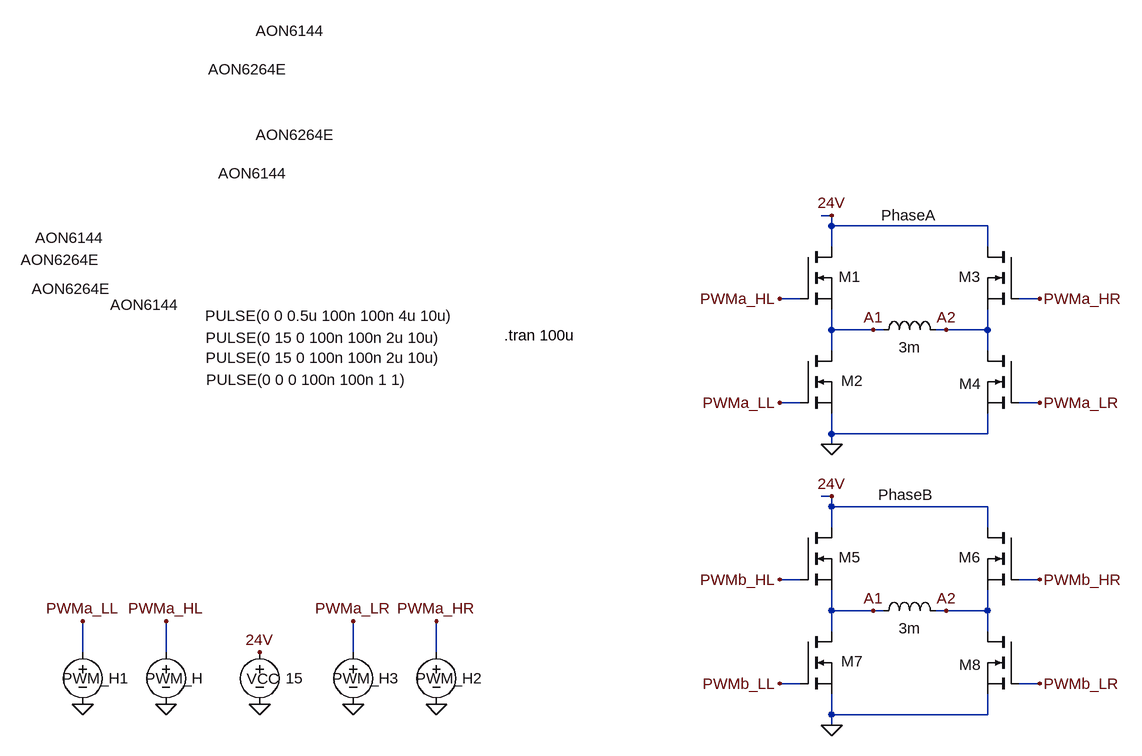
[diagram p0: schematic Stepper motor Driver.asc]
Stepper motor Driver.asc, the LTspice schematic file:
Version 4
SHEET 1 1612 680
WIRE 256 -560 240 -560
WIRE 256 -544 256 -560
WIRE 496 -544 256 -544
WIRE 256 -512 256 -544
WIRE 496 -512 496 -544
WIRE 208 -432 176 -432
WIRE 576 -432 544 -432
WIRE 256 -384 256 -416
WIRE 320 -384 256 -384
WIRE 336 -384 320 -384
WIRE 432 -384 416 -384
WIRE 496 -384 496 -416
WIRE 496 -384 432 -384
WIRE 256 -352 256 -384
WIRE 496 -352 496 -384
WIRE 208 -272 176 -272
WIRE 576 -272 544 -272
WIRE 256 -224 256 -256
WIRE 496 -224 496 -256
WIRE 496 -224 256 -224
WIRE 256 -208 256 -224
WIRE 256 -128 240 -128
WIRE 256 -112 256 -128
WIRE 496 -112 256 -112
WIRE 256 -80 256 -112
WIRE 496 -80 496 -112
WIRE 208 0 176 0
WIRE 576 0 544 0
WIRE 256 48 256 16
WIRE 320 48 256 48
WIRE 336 48 320 48
WIRE 432 48 416 48
WIRE 496 48 496 16
WIRE 496 48 432 48
WIRE 256 80 256 48
WIRE 496 80 496 48
WIRE -896 112 -896 64
WIRE -768 112 -768 64
WIRE -480 112 -480 64
WIRE -352 112 -352 64
WIRE 208 160 176 160
WIRE 576 160 544 160
WIRE 256 208 256 176
WIRE 496 208 496 176
WIRE 496 208 256 208
WIRE 256 224 256 208
FLAG 256 -560 24V
FLAG -624 112 24V
FLAG -624 192 0
FLAG 256 -208 0
FLAG -768 192 0
FLAG -768 64 PWMa_HL
FLAG -896 192 0
FLAG -896 64 PWMa_LL
FLAG 176 -432 PWMa_HL
FLAG 176 -272 PWMa_LL
FLAG 576 -432 PWMa_HR
FLAG 576 -272 PWMa_LR
FLAG -352 192 0
FLAG -352 64 PWMa_HR
FLAG -480 192 0
FLAG -480 64 PWMa_LR
FLAG 320 -384 A1
FLAG 432 -384 A2
FLAG 256 -128 24V
FLAG 256 224 0
FLAG 176 0 PWMb_HL
FLAG 176 160 PWMb_LL
FLAG 576 0 PWMb_HR
FLAG 576 160 PWMb_LR
FLAG 320 48 A1
FLAG 432 48 A2
SYMBOL voltage -768 96 R0
WINDOW 123 0 0 Left 0
WINDOW 39 0 0 Left 0
WINDOW 0 -32 56 Left 2
WINDOW 3 61 -437 Left 2
SYMATTR InstName PWM_H
SYMATTR Value PULSE(0 15 0 100n 100n 2u 10u)
SYMBOL voltage -624 96 R0
WINDOW 0 -20 57 Left 2
WINDOW 3 40 56 Left 2
WINDOW 123 0 0 Left 0
WINDOW 39 0 0 Left 0
SYMATTR InstName VCC
SYMATTR Value 15
SYMBOL nmos 208 -352 R0
WINDOW 3 -838 -332 Left 2
WINDOW 0 59 -114 Left 2
SYMATTR Value AON6264E
SYMATTR InstName M1
SYMBOL voltage -896 96 R0
WINDOW 123 0 0 Left 0
WINDOW 39 0 0 Left 0
WINDOW 0 -32 56 Left 2
WINDOW 3 188 -502 Left 2
SYMATTR InstName PWM_H1
SYMATTR Value PULSE(0 0 0.5u 100n 100n 4u 10u)
SYMBOL nmos 544 -352 M0
WINDOW 3 1126 -273 Left 2
WINDOW 0 59 -114 Left 2
SYMATTR Value AON6144
SYMATTR InstName M3
SYMBOL voltage -352 96 R0
WINDOW 123 0 0 Left 0
WINDOW 39 0 0 Left 0
WINDOW 0 -32 56 Left 2
WINDOW 3 -354 -403 Left 2
SYMATTR InstName PWM_H2
SYMATTR Value PULSE(0 0 0 100n 100n 1 1)
SYMBOL voltage -480 96 R0
WINDOW 123 0 0 Left 0
WINDOW 39 0 0 Left 0
WINDOW 0 -32 56 Left 2
WINDOW 3 -227 -468 Left 2
SYMATTR InstName PWM_H3
SYMATTR Value PULSE(0 15 0 100n 100n 2u 10u)
SYMBOL ind 320 -368 R270
WINDOW 0 177 54 VTop 2
WINDOW 3 5 56 VBottom 2
SYMATTR InstName PhaseA
SYMATTR Value 3m
SYMATTR SpiceLine Ipk=10 Rser=0 Rpar=20
SYMBOL nmos 208 -512 R0
WINDOW 3 -838 -332 Left 2
WINDOW 0 63 206 Left 2
SYMATTR Value AON6144
SYMATTR InstName M2
SYMBOL nmos 544 -512 M0
WINDOW 3 1126 -273 Left 2
WINDOW 0 58 211 Left 2
SYMATTR Value AON6264E
SYMATTR InstName M4
SYMBOL nmos 208 80 R0
WINDOW 3 -1183 -527 Left 2
WINDOW 0 59 -114 Left 2
SYMATTR Value AON6264E
SYMATTR InstName M5
SYMBOL nmos 544 80 M0
WINDOW 3 1292 -503 Left 2
WINDOW 0 59 -114 Left 2
SYMATTR Value AON6144
SYMATTR InstName M6
SYMBOL ind 320 64 R270
WINDOW 0 179 50 VTop 2
WINDOW 3 5 56 VBottom 2
SYMATTR InstName PhaseB
SYMATTR Value 3m
SYMATTR SpiceLine Ipk=10 Rser=0 Rpar=20
SYMBOL nmos 208 -80 R0
WINDOW 3 -1177 -446 Left 2
WINDOW 0 63 206 Left 2
SYMATTR Value AON6144
SYMATTR InstName M7
SYMBOL nmos 544 -80 M0
WINDOW 3 1414 -412 Left 2
WINDOW 0 58 211 Left 2
SYMATTR Value AON6264E
SYMATTR InstName M8
TEXT -248 -376 Left 2 !.tran 100u

The netlist it stands for:
* Stepper motor Driver.asc
V§PWM_H PWMa_HL 0 PULSE(0 15 0 100n 100n 2u 10u)
VCC 24V 0 15
M1 A1 PWMa_LL 0 0 AON6264E
V§PWM_H1 PWMa_LL 0 PULSE(0 0 0.5u 100n 100n 4u 10u)
M3 A2 PWMa_LR 0 0 AON6144
V§PWM_H2 PWMa_HR 0 PULSE(0 0 0 100n 100n 1 1)
V§PWM_H3 PWMa_LR 0 PULSE(0 15 0 100n 100n 2u 10u)
L§PhaseA A1 A2 3m Ipk=10 Rser=0 Rpar=20
M2 24V PWMa_HL A1 A1 AON6144
M4 24V PWMa_HR A2 A2 AON6264E
M5 A1 PWMb_LL 0 0 AON6264E
M6 A2 PWMb_LR 0 0 AON6144
L§PhaseB A1 A2 3m Ipk=10 Rser=0 Rpar=20
M7 24V PWMb_HL A1 A1 AON6144
M8 24V PWMb_HR A2 A2 AON6264E
.model NMOS NMOS
.model PMOS PMOS
.lib standard.mos
.tran 100u
.backanno
.end